# EAGLE design JTAGTest1 (EAGLE 9.1.3)
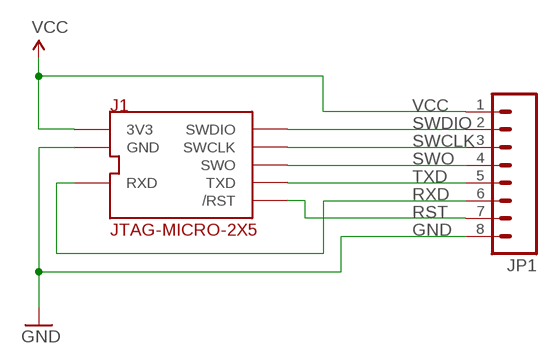
[diagram p0: schematic, sheet 1]

## Parts
J1  JTAG-MICRO-2X5  [JTAG-MICRO-2X5]
JP1  M08SILK_FEMALE_PTH  [1X08]

## Nets
GND: J1.3(GND) J1.5(GND) J1.9(GND) JP1.8
RST: J1.10(/RST) JP1.7
RXD: J1.7(RXD) JP1.6
SWCLK: J1.4(SWCLK) JP1.3
SWDIO: J1.2(SWDIO) JP1.2
SWO: J1.6(SWO) JP1.4
TXD: J1.8(TXD) JP1.5
VCC: J1.1(3V3) JP1.1

## Library data of the parts
J1 = rickk2:JTAG-MICRO-2X5: JTAG Connector $2.90 CONN HEADER SMD 10POS 1.27MM Connector Header Surface Mount 10 position 0.050" (1.27mm) Samtec FTSH-105-01-F-DV-K https://www.digikey.com/product-detail/en/FTSH-105-01-F-DV-K/SAM8796-ND/2649974?utm_campaign=buynow&WT.z_cid=ref_octopart_dkc_buynow&utm_medium=aggregator&curr=usd&site=us&utm_source=octopart
JP1 = rickk2:M08: Header 8 Standard 8-pin 0.1" header. Use with straight break away headers (SKU : PRT-00116), right angle break away headers (PRT-00553), swiss pins (PRT-00743), machine pins (PRT-00117), and female headers (PRT-00115).; PROD_ID: CONN-08438

## Board
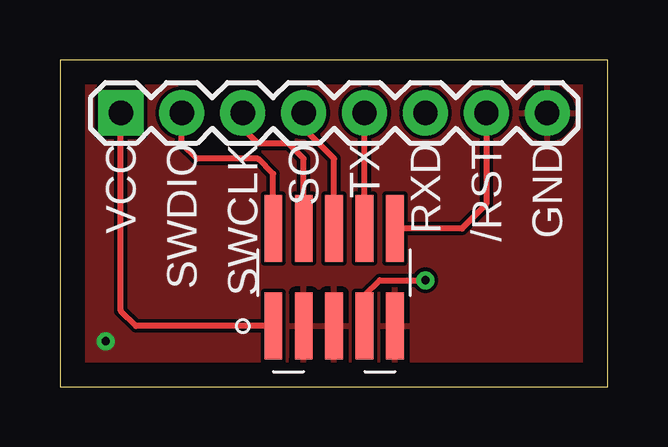
[diagram p1: board, top side]
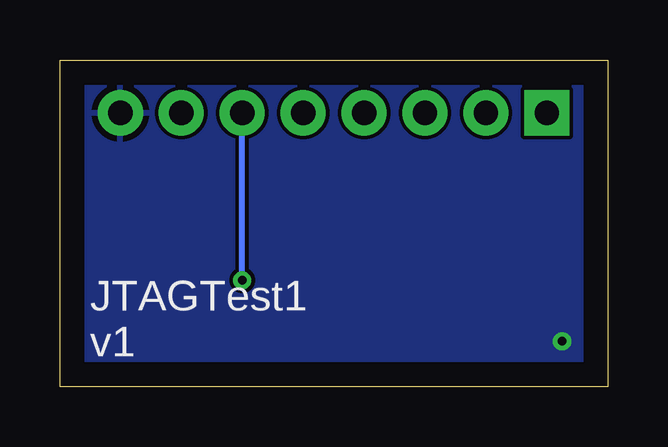
[diagram p2: board, bottom side, seen from below]

Size 22.84 x 13.64 mm. Coordinates in mm from the lower left corner, seen from the top.
Outline: 0,0 22.84,0 22.84,13.64 0,13.64 0,0
Copper layers (1*16): Top 0.035mm / dielectric 1.5mm / Bottom 0.035mm
Design rules "default": minimum track width 6mil, minimum drill 0.35mm, track to track 6mil, track to pad 6mil, pad to pad 6mil, via to via 6mil, smd to smd 6mil, copper to edge 40mil, drill to drill 6mil, minimum pad ring 10mil, minimum via ring 8mil, stop-mask expansion 4mil, vias tented up to drill 0mil, thermal gap 10mil

### Footprints (pad centres in the part's own frame; a part is rotated, then mirrored left to right if it is on the bottom)
JTAG-MICRO-2X5 = smd 0.737 x 2.794: 1 0,0; 2 0,4.064; 3 1.27,0; 4 1.27,4.064; 5 2.54,0; 6 2.54,4.064; 7 3.81,0; 8 3.81,4.064; 9 5.08,0; 10 5.08,4.064
1X08 = drill 1.016 pad 1.88 square: 1 0,0 | drill 1.016 pad 1.88: 2 2.54,0; 3 5.08,0; 4 7.62,0; 5 10.16,0; 6 12.7,0; 7 15.24,0; 8 17.78,0

### Placement (x,y rotation side)
J1  8.89,2.54 0 top
JP1  2.54,11.43 0 top

### Tracks (layer width: path | path; a pad name or v marks a point on that pad's centre or on a via)
GND  (via drill 0.35)
  other vias: 1.91,1.91
  pour Top: 0,0 0,15.24 24.13,15.24 24.13,0
  pour Bottom: 0,0 0,16.51 24.13,16.51 24.13,0
RST
  Top 0.254: JP1.7 17.78,7.62 16.76,6.6 J1.10
RXD  (via drill 0.35)
  Top 0.254: J1.7 12.7,3.81 13.34,4.45 v15.24,4.45
  Bottom 0.254: v15.24,4.45 JP1.6
SWCLK
  Top 0.254: J1.4 10.16,9.53 9.53,10.16 8.26,10.16 7.62,10.79 JP1.3
SWDIO
  Top 0.254: J1.2 8.89,8.89 8.26,9.53 5.71,9.53 5.08,10.16 JP1.2
SWO
  Top 0.254: J1.6 11.43,9.53 10.16,10.79 JP1.4
TXD
  Top 0.254: J1.8 JP1.5
VCC
  Top 0.254: J1.1 3.17,2.54 2.54,3.17 JP1.1

### Text on the board
tPlace: VCC | SWDIO | SWCLK | SO | TX | RXD | /RST | GND
bPlace: JTAGTest1 / v1